# EAGLE design main (EAGLE 8.4.1)
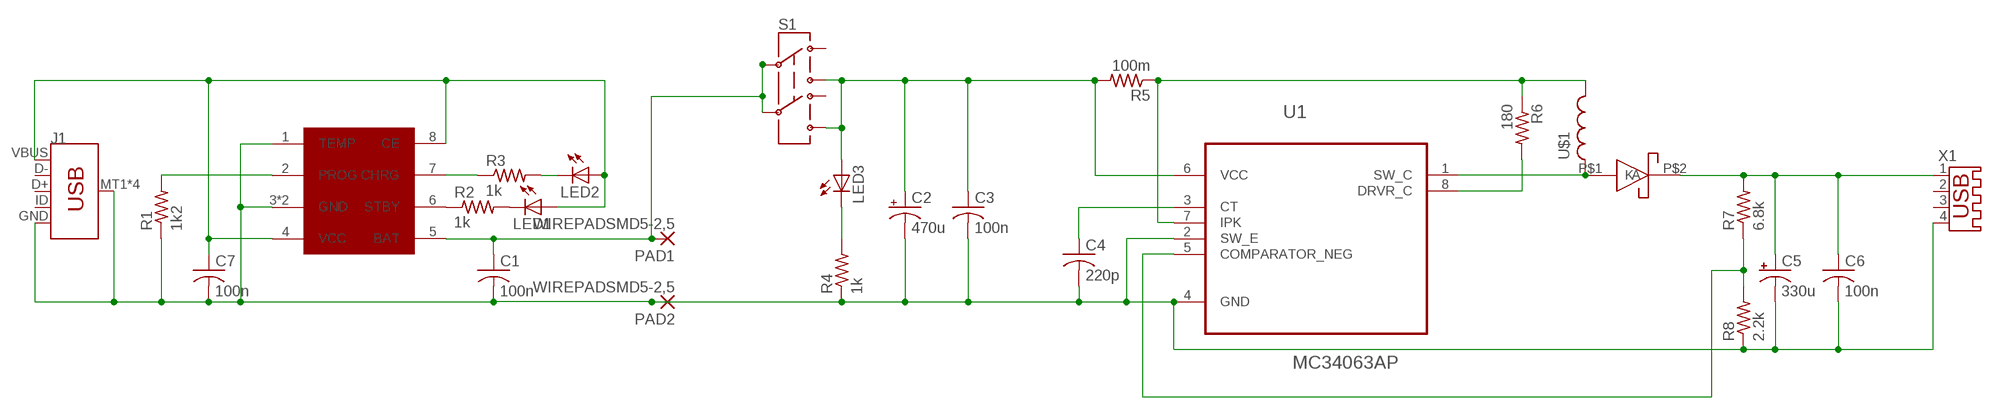
[diagram p0: schematic, sheet 1]

## Parts
C1  100n  C-USC0603  [C0603]
C2  470u  CPOL-USE5-10.5  [E5-10,5]
C3  100n  C-USC0603  [C0603]
C4  220p  C-US025-025X050  [C025-025X050]
C5  330u  CPOL-USE3.5-8  [E3,5-8]
C6  100n  C-USC0603  [C0603]
C7  100n  C-USC0603  [C0603]
CH1  TP4056  [SOP8]
D1  SS34  [DO-214AB]
J1  USB_MICRO-B_SMT  [USB-MICROB]
LED1  LEDCHIP-LED0805  [CHIP-LED0805]
LED2  LEDCHIP-LED0805  [CHIP-LED0805]
LED3  LEDCHIP-LED0805  [CHIP-LED0805]
PAD1  WIREPADSMD5-2,5  [5-2,5]
PAD2  WIREPADSMD5-2,5  [5-2,5]
R1  1k2  R-US_M0805  [M0805]
R2  1k  R-US_M0805  [M0805]
R3  1k  R-US_M0805  [M0805]
R4  1k  R-US_M0805  [M0805]
R5  100m  R-US_R0603  [R0603]
R6  180  R-US_0309/V  [0309V]
R7  6.8k  R-US_0204/5  [0204/5]
R8  2.2k  R-US_M0805  [M0805]
S1  SWITCH-DPDTEG2211  [EG2211]
U1  MC34063AP  [DIP254P762X508-8]
U$1  DO540H  [DO540H]
X1  USB-A003  [USB-A003]

## Nets
GND: C1.2 C2.- C3.2 C4.2 C5.- C6.2 C7.2 CH1.1(TEMP) CH1.3(GND) CH1.9(GND) J1.GND J1.MT1(SHIELD) J1.MT2(SHIELD) J1.P$1(SHIELD) J1.P$2(SHIELD) PAD2.1(P) R1.1 R4.1 R8.1 U1.2(SW_E) U1.4(GND) X1.4
N$1: CH1.6(STBY) R2.1
N$2: C1.1 CH1.5(BAT) PAD1.1(P) S1.P1 S1.P2
N$3: CH1.7(CHRG) R3.1
N$5: D1.P$1(A) U1.1(SW_C) U$1.P$2
N$6: LED1.C R2.2
N$7: LED2.C R3.2
N$8: C7.1 CH1.4(VCC) CH1.8(CE) J1.VBUS LED1.A LED2.A
N$9: LED3.C R4.2
N$10: CH1.2(PROG) R1.2
N$11: C2.+ C3.1 LED3.A R5.2 S1.P1-TB S1.P2-TB U1.6(VCC)
N$12: C5.+ C6.1 D1.P$2(K) R7.2 X1.1
N$13: R7.1 R8.2 U1.5(COMPARATOR_NEG)
N$14: R6.2 U1.8(DRVR_C)
N$15: C4.1 U1.3(CT)
N$16: R5.1 R6.1 U1.7(IPK) U$1.P$1
Unconnected: J1.D+ J1.D- J1.ID S1.P1-TA S1.P2-TA X1.2 X1.3

## Library data of the parts
C1 C3 C4 C6 C7 = adafruit:C-US: CAPACITOR, American symbol
C2 C5 = adafruit:CPOL-US: POLARIZED CAPACITOR, American symbol
CH1 = 7_segment_lib:TP4056
D1 = 7_segment_lib:SS34
J1 = SparkFun-Connectors:USB_MICRO-B: USB Type Micro-B Connector Male/female and PTH/SMT variants SparkFun Products: SparkFun microB USB Breakout <https://www.sparkfun.com/products/12035> SparkFun USB microB Plug Breakout <https://www.sparkfun.com/products/10031> SparkFun ESP8266 Thing <https://www.sparkfun.com/products/13231>; PROD_ID: CONN-09505; SF_ID: PRT-08533
LED1-LED3 = adafruit:LED: LED OSRAM: - CHIPLED LG R971, LG N971, LY N971, LG Q971, LY Q971, LO R971, LY R971 LH N974, LH R974 LS Q976, LO Q976, LY Q976 LO Q996 - Hyper CHIPLED LW Q18S LB Q993, LB Q99A, LB R99A - SideLED LS A670, LO A670, LY A670, LG A670, LP A670 LB A673, LV A673, LT A673, LW A673 LH A674 LY A675 LS A676, LA A676, LO A676, LY A676, LW A676 LS A679, LY A679, LG A679 - Hyper Micro SIDELED® LS Y876, LA Y876, LO Y876, LY Y876 LT Y87S - SmartLED LW L88C, LW L88S LB L89C, LB L89S, LG L890 LS L89K, LO L89K, LY L89K LS L896, LA L896, LO L896, LY L896 - TOPLED LS T670, LO T670, LY T670, LG T670, LP T670 LSG T670, LSP T670, LSY T670, LOP T670, LYG T670 LG T671, LOG T671, LSG T671 LB T673, LV T673, LT T673, LW T673 LH T674 LS T676, LA T676, LO T676, LY T676, LB T676, LH T676, LSB T676, LW T676 LB T67C, LV T67C, LT T67C, LS T67K, LO T67K, LY T67K, LW E67C LS E67B, LA E67B, LO E67B, LY E67B, LB E67C, LV E67C, LT E67C LW T67C LS T679, LY T679, LG T679 LS T770, LO T770, LY T770, LG T770, LP T770 LB T773, LV T773, LT T773, LW T773 LH T774 LS E675, LA E675, LY E675, LS T675 LS T776, LA T776, LO T776, LY T776, LB T776 LHGB T686 LT T68C, LB T68C - Hyper Mini TOPLED® LB M676 - Mini TOPLED Santana® LG M470 LS M47K, LO M47K, LY M47K Source: http://www.osram.convergy.de/
PAD1 PAD2 = wirepad:WIREPAD: Wire PAD connect wire on PCB
R1-R8 = adafruit:R-US_: RESISTOR, American symbol
S1 = SparkFun-Retired:SWITCH-DPDT: DPDT Version of the COM-00597
U1 = Texas Instruments_By_element14_Batch_1:MC34063AP: REGULATORS; MPN: MC34063AP; OC_FARNELL: 1053579; OC_NEWARK: 04K3500; PACKAGE: PDIP-8; SUPPLIER: Texas Instruments
U$1 = inductor-coilcraft:DO540H
X1 = con-yamaichi:USB-A003: USB connector; OC_FARNELL: unknown; OC_NEWARK: unknown

## Board
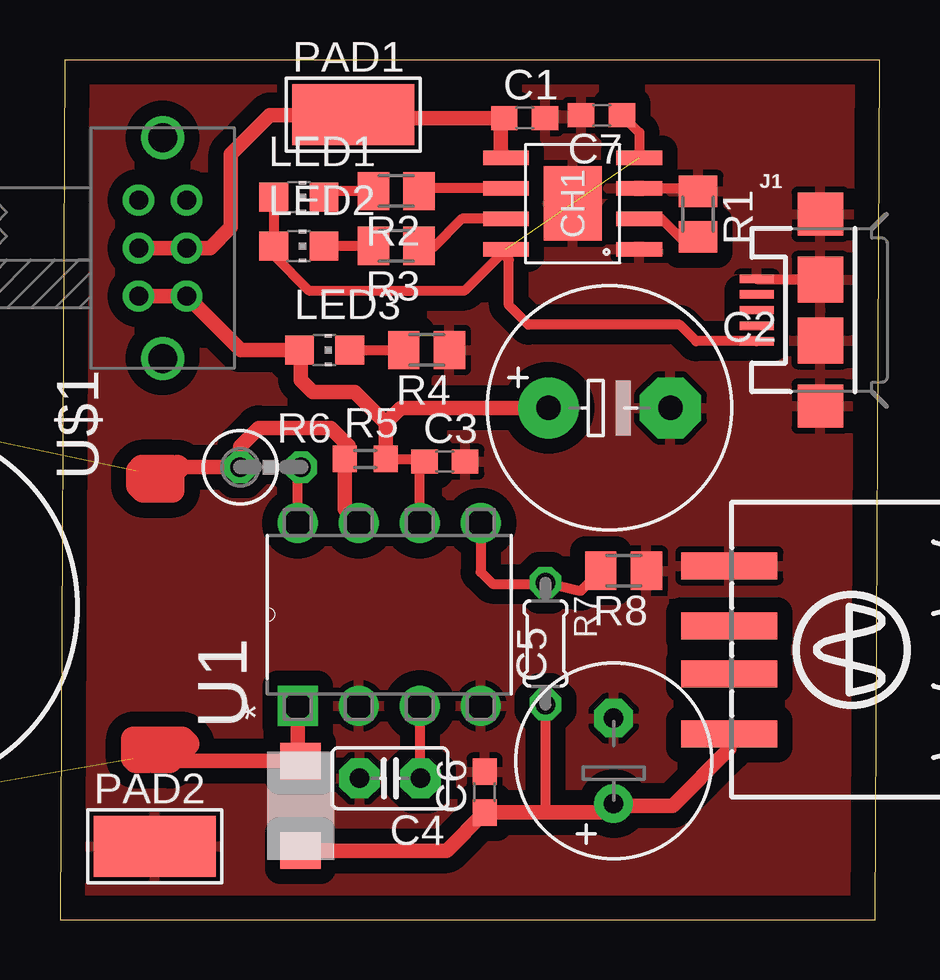
[diagram p1: board, top side]

Size 34.16 x 35.84 mm. Coordinates in mm from the lower left corner, seen from the top.
Outline: 0,0 33.96,0 34.16,35.84 0.2,35.84 0,0
Copper layers (1*16): Top 0.035mm / dielectric 1.5mm / Bottom 0.035mm
Design rules "default": minimum track width 10mil, minimum drill 24mil, track to track 8mil, track to pad 8mil, pad to pad 8mil, via to via 8mil, smd to smd 8mil, copper to edge 40mil, drill to drill 8mil, minimum pad ring 10mil, minimum via ring 8mil, stop-mask expansion 4mil, vias tented up to drill 0mil, thermal gap 10mil

### Footprints (pad centres in the part's own frame; a part is rotated, then mirrored left to right if it is on the bottom)
C0603 = smd 1.1 x 1: 1 -0.85,0; 2 0.85,0
E5-10,5 = drill 1.016 pad 2.54: + -2.54,0 | drill 1.016 pad 2.54 octagon: - 2.54,0
C025-025X050 = drill 0.813 pad 1.676 octagon: 1 -1.27,0; 2 1.27,0
E3,5-8 = drill 0.813 pad 1.6: + -1.778,0 | drill 0.813 pad 1.6 octagon: - 1.778,0
SOP8 = smd 0.61 x 1.91: 1 -1.905,-2.78; 2 -0.635,-2.78; 3 0.635,-2.78; 4 1.905,-2.78; 5 1.905,2.78; 6 0.635,2.78; 7 -0.635,2.78; 8 -1.905,2.78 | smd 3.1 x 2.41: 9 0,0
DO-214AB = smd 1.52 x 1.68: P$1 -1.87,0; P$2 1.87,0
USB-MICROB = smd 1.4 x 0.35: D+ -2.65,0; D- -2.65,-0.65; GND -2.65,1.3; ID -2.65,0.65; VBUS -2.65,-1.3 | smd 1.9 x 1.8: MT1 0,-4; MT2 0,4 | smd 1.9 x 1.9: P$1 0,-1.27; P$2 0,1.27
CHIP-LED0805 = smd 1.2 x 1.2: A 0,-1.05; C 0,1.05
5-2,5 = smd 2.54 x 5.08: 1 0,0
M0805 = smd 1.3 x 1.6: 1 -0.95,0; 2 0.95,0
R0603 = smd 1 x 1.1: 1 -0.85,0; 2 0.85,0
0309V = drill 0.813 octagon: 1 -1.27,0; 2 1.27,0
0204/5 = drill 0.813 octagon: 1 -2.54,0; 2 2.54,0
EG2211 = drill 0.8: P1 -1,0; P1-TA -1,2; P1-TB -1,-2; P2 1,0; P2-TA 1,2; P2-TB 1,-2 | drill 1.2: P$7 0,4.6; P$8 0,-4.6
DIP254P762X508-8 = drill 1.118 square: 1 -7.62,7.62 | drill 1.118: 2 -7.62,5.08; 3 -7.62,2.54; 4 -7.62,0; 5 0,0; 6 0,2.54; 7 0,5.08; 8 0,7.62
DO540H = smd 1.9 x 6.35: P$1 -7.85,-0.1; P$2 8.05,-0.1
USB-A003 = smd 1.12 x 4: 1 -3.5,14; 2 -1,14; 3 1,14; 4 3.5,14

### Placement (x,y rotation side)
C1  19.36,33.41 0 top
C2  22.89,21.34 0 top
C3  16.03,19.09 0 top
C4  13.75,5.89 180 top
C5  23.07,6.62 90 top
C6  17.7,5.32 90 top
C7  22.57,33.54 180 top
CH1  21.36,29.86 90 top
D1  10.03,4.75 270 top
J1  31.68,25.41 0 top
LED1  9.95,30.12 270 top
LED2  9.95,28.09 270 top
LED3  11.03,23.75 270 top
PAD1  12.22,33.56 270 top
PAD2  3.94,3.06 270 top
R1  26.59,29.41 270 top
R2  14.01,30.38 180 top
R3  14.01,28.09 180 top
R4  15.28,23.75 180 top
R5  12.72,19.21 0 top
R6  8.78,18.86 0 top
R7  20.22,11.52 270 top
R8  23.48,14.55 180 top
S1  4.28,28 0 top
U1  17.53,16.54 90 top
U$1  -6.9,13.02 270 top  (outside the outline)
X1  41.89,11.26 90 top

### Tracks (layer width: path | path; a pad name or v marks a point on that pad's centre or on a via)
GND
  Top 0.406: CH1.3 26.46,30.49 R1.1 | J1.GND 31.65,26.71 J1.P$2
  pour Top (isolate 0.635): -2.92,41.74 36.66,40.49 35.66,-4.35 -3.92,-2.85
N$1
  Top 0.406: CH1.6 15.08,30.49 R2.1
N$2
  Top 0.406: 18.36,33.56 C1.1 | 18.51,31.83 CH1.5
  Top 0.61: S1.P1 S1.P2 6.25,28 7.12,28.87 7.12,31.92 8.75,33.54 12.21,33.54 | 12.21,33.54 PAD1.1 | 18.36,33.56 18.36,31.98 18.51,31.83 | C1.1 12.34,33.41 12.21,33.54
N$3
  Top 0.406: CH1.7 16.74,29.22 15.53,28 15.04,28 R3.1
N$5  (1 unrouted)
  Top 0.61: U1.1 9.91,6.74 D1.P$1 3.87,6.62
  Top 1.016: 3.65,6.62 3.16,6.62 3.06,6.72 3.06,7.53 5.09,7.53 5.29,7.33 4.58,6.62 3.87,6.62
N$6
  Top 0.406: R2.2 11.25,30.38 LED1.C
N$7
  Top 0.406: R3.2 LED2.C
N$8  (1 unrouted)
  Top 0.406: LED1.A LED2.A 8.9,27.7 10.37,26.23 16.86,26.23 18.42,27.79 | 18.42,27.79 CH1.8 | J1.VBUS 26.51,24.11 25.82,24.81 19.52,24.81 18.7,25.62 18.7,27.51 18.42,27.79 | C7.1 24.14,32.82 CH1.4
  Top 0.61: 8.81,28 LED2.A
N$9
  Top 0.406: LED3.C R4.2
N$10
  Top 0.406: CH1.2 25.05,29.22 26.02,28.25 26.38,28.25 R1.2
N$11
  Top 0.406: U1.6 14.99,18.91 C3.1 15.06,19.21 R5.2
  Top 0.61: 13.57,20.7 R5.2 | 13.57,20.7 12.28,22 10.53,22 10.03,22.5 10.03,23.7 LED3.A 7.53,23.75 S1.P2-TB S1.P1-TB | C2.+ 14.2,21.34 13.57,20.7
N$12
  Top 0.406: R7.2 20.22,4.52 20.27,4.47
  Top 0.61: X1.1 27.89,7.12 25.52,4.75 23.16,4.75 C5.+ 22.7,4.47 20.27,4.47 C6.1 16.1,2.88 D1.P$2
N$13
  Top 0.406: U1.5 17.53,14.49 18.02,14 19.94,14 R7.1 21.7,13.71 R8.2
N$14
  Top 0.406: U1.8 9.91,18.73 R6.2
N$15
  Top 0.406: U1.3 14.99,5.92 C4.1
N$16  (1 unrouted)
  Top 0.61: 4.89,18.86 R6.1 7.51,19.73 8.28,20.5 11.28,20.5 12.03,19.75 12.03,19.36 R5.1 11.87,17.11 U1.7
  Top 1.016: 4.65,18.86 3.42,18.86 3.26,18.71 3.26,18.1 3.47,17.9 4.68,17.9 4.68,18.66 4.89,18.86